# EAGLE design Tah (EAGLE 6.4)
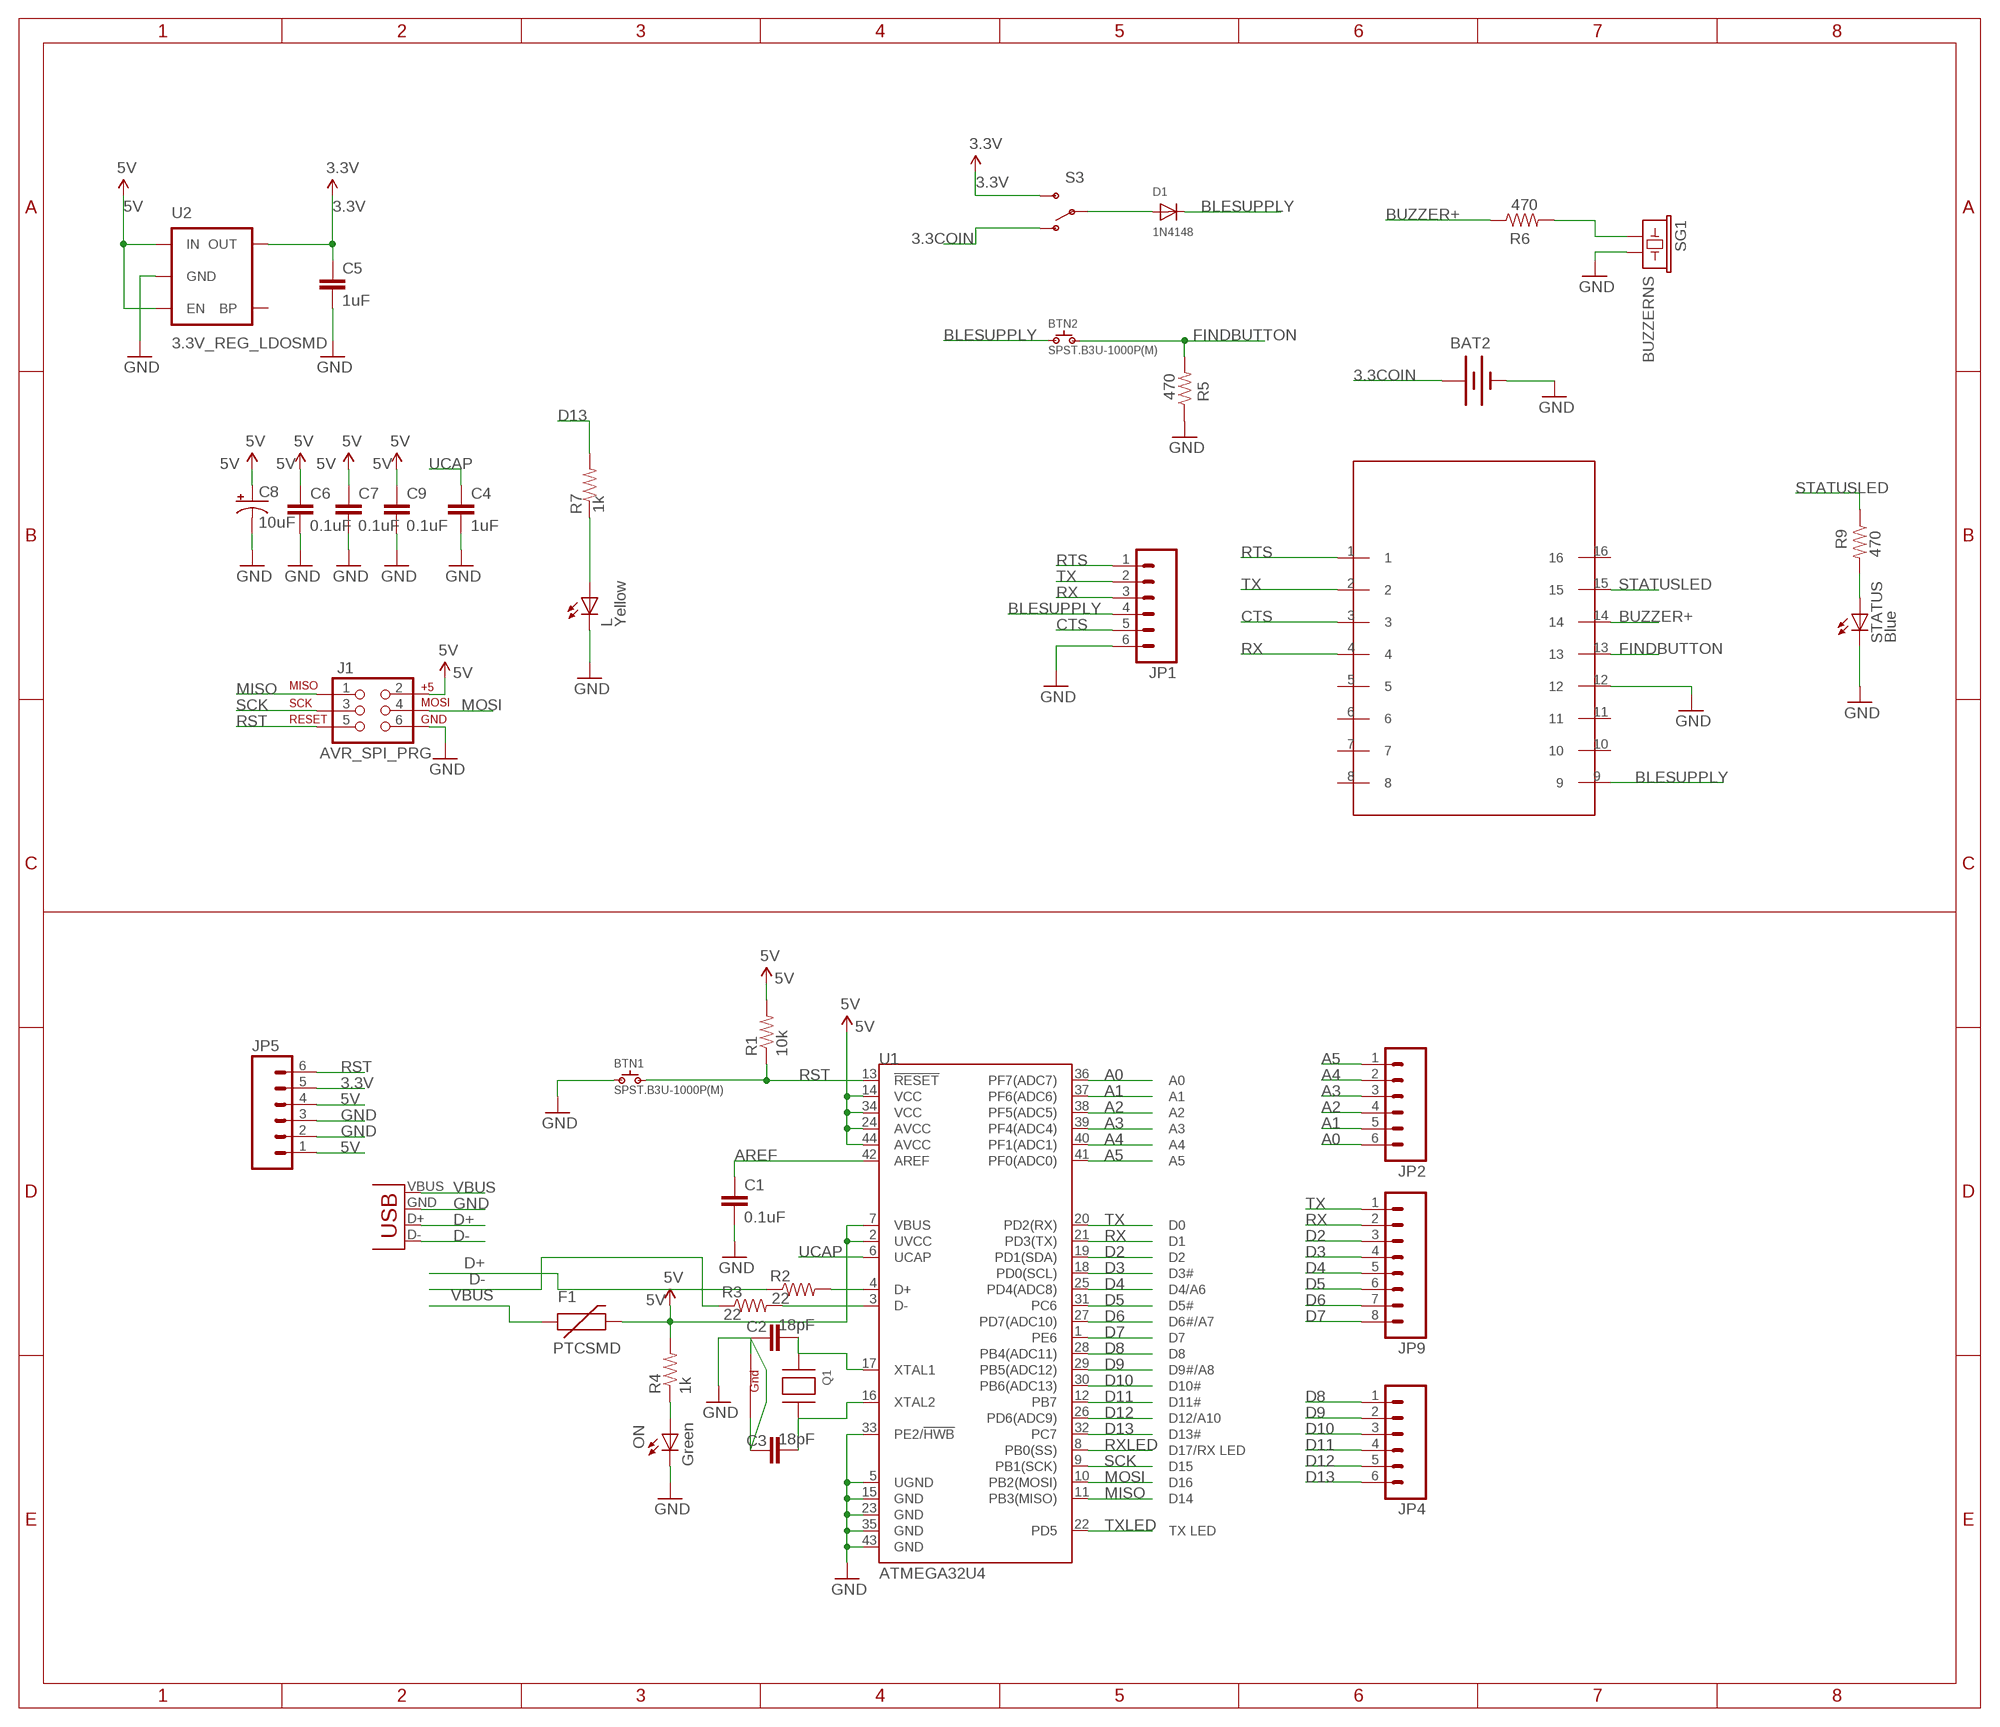
[diagram p0: schematic, sheet 1]

## Parts
BAT2  BATTERY20SMD  [BATTCON_20MM]
BLE  HM-11HM11  [BC05B-SMD]
BTN1  SPST.B3U-1000P(M)  [B3U-1000P(M)]
BTN2  SPST.B3U-1000P(M)  [B3U-1000P(M)]
C1  0.1uF  2.2UF-CERCAP-10009  [1206]
C2  18pF  2.2UF-CERCAP-10009  [1206]
C3  18pF  2.2UF-CERCAP-10009  [1206]
C4  1uF  2.2UF-CERCAP-10009  [1206]
C5  1uF  2.2UF-CERCAP-10009  [1206]
C6  0.1uF  2.2UF-CERCAP-10009  [1206]
C7  0.1uF  2.2UF-CERCAP-10009  [1206]
C8  10uF  CAP_POL1206  [EIA3216]
C9  0.1uF  2.2UF-CERCAP-10009  [1206]
D1  1N4148  DIODESMA  [SMADIODE]
F1  PTCSMD  [PTC-1206]
J1  AVR_SPI_PRG  AVR_SPI_PRG_6PTH  [2X3]
JP1  M06SIP  [1X06]
JP2  M06SIP  [1X06]
JP4  M06SIP  [1X06]
JP5  M06SIP  [1X06]
JP7  USB-A-H  [USB-A-H]
JP9  M081X08  [1X08]
L  Yellow  LEDSMT1206  [1206]
ON  Green  LEDSMT1206  [1206]
Q1  XTAL-4-3225  [NX3225]
R1  10k  RESISTOR1206  [1206]
R2  22  RESISTOR1206  [1206]
R3  22  RESISTOR1206  [1206]
R4  1k  RESISTOR1206  [1206]
R5  470  RESISTOR1206  [1206]
R6  470  RESISTOR1206  [1206]
R7  1k  RESISTOR1206  [1206]
R9  470  RESISTOR1206  [1206]
S3  SWITCH-SPDT-SMD-A  [SWITCH-SPST-SMD-A]
SG1  BUZZERNS  [BUZZER-12MM-NS]
STATUS  Blue  LEDSMT1206  [1206]
U1  ATMEGA32U4  ATMEGA32U4TQFP  [SPARKFUN-DIGITALIC_TQFP44]
U2  3.3V_REG_LDOSMD  V_REG_LDOSMD  [SOT23-5]

## Nets
3.3COIN: BAT2.1(+) S3.1(O)
3.3V: C5.1 JP5.5 S3.3(S) U2.5(OUT)
5V: C6.1 C7.1 C8.A(+) C9.1 F1.2 J1.2 JP5.1 JP5.4 R1.2 R4.2 U1.2(UVCC) U1.7(VBUS) U1.14(VCC) U1.24(AVCC) U1.34(VCC) U1.44(AVCC) U2.1(IN) U2.3(EN)
A0: JP2.6 U1.36(PF7(ADC7))
A1: JP2.5 U1.37(PF6(ADC6))
A2: JP2.4 U1.38(PF5(ADC5))
A3: JP2.3 U1.39(PF4(ADC4))
A4: JP2.2 U1.40(PF1(ADC1))
A5: JP2.1 U1.41(PF0(ADC0))
AREF: C1.1 U1.42(AREF)
BLESUPPLY: BLE.9 BTN2.1 D1.C JP1.4
BUZZER+: BLE.14 R6.1
CTS: BLE.3 JP1.5
D2: JP9.3 U1.19(PD1(SDA))
D3: JP9.4 U1.18(PD0(SCL))
D4: JP9.5 U1.25(PD4(ADC8))
D5: JP9.6 U1.31(PC6)
D6: JP9.7 U1.27(PD7(ADC10))
D7: JP9.8 U1.1(PE6)
D8: JP4.1 U1.28(PB4(ADC11))
D9: JP4.2 U1.29(PB5(ADC12))
D10: JP4.3 U1.30(PB6(ADC13))
D11: JP4.4 U1.12(PB7)
D12: JP4.5 U1.26(PD6(ADC9))
D13: JP4.6 R7.2 U1.32(PC7)
D+: JP7.D+(D-) R2.1
D-: JP7.D-(D+) R3.1
FINDBUTTON: BLE.13 BTN2.2 R5.2
GND: BAT2.2(-) BLE.12 BTN1.1 C1.2 C2.1 C3.1 C4.2 C5.2 C6.2 C7.2 C8.C(-) C9.2 J1.6 JP1.6 JP5.2 JP5.3 JP7.GND(VBUS) L.C ON.C Q1.2(G2) Q1.4(G1) R5.1 SG1.- STATUS.C U1.5(UGND) U1.15(GND) U1.23(GND) U1.33(PE2/!HWB) U1.35(GND) U1.43(GND) U2.2(GND)
MISO: J1.1 U1.11(PB3(MISO))
MOSI: J1.4 U1.10(PB2(MOSI))
N$1: L.A R7.1
N$2: C2.2 Q1.1(X1) U1.17(XTAL1)
N$3: C3.2 Q1.3(X2) U1.16(XTAL2)
N$4: R6.2 SG1.+
N$6: R2.2 U1.4(D+)
N$8: R3.2 U1.3(D-)
N$9: ON.A R4.1
N$11: R9.2 STATUS.A
N$17: D1.A S3.2(P)
RST: BTN1.2 J1.5 JP5.6 R1.1 U1.13(!RESET)
RTS: BLE.1 JP1.1
RX: BLE.4 JP1.3 JP9.2 U1.21(PD3(TX))
RXLED: U1.8(PB0(SS))
SCK: J1.3 U1.9(PB1(SCK))
STATUSLED: BLE.15 R9.1
TX: BLE.2 JP1.2 JP9.1 U1.20(PD2(RX))
TXLED: U1.22(PD5)
UCAP: C4.1 U1.6(UCAP)
VBUS: F1.1 JP7.VBUS(GND)
Unconnected: BLE.5 BLE.6 BLE.7 BLE.8 BLE.10 BLE.11 BLE.16 U2.4(BP)

## Library data of the parts
BAT2 = SparkFun-Electromechanical:BATTERY: Battery Holders Various common sizes : AA, AAA, 20mm coin cell and 12mm coin cell. 20MM_4LEGS, BATT-10373
BLE = HM-11:HM-11
BTN1 BTN2 = omron:SPST
C1-C7 C9 = SparkFun-Capacitors:2.2UF-CER: 2.2uF Ceramic SMT CAP-07888- 10V, 20% (0603) CAP-10009- 50V, 10% (1206); PROD_ID: CAP-10009; VALUE: 2.2uF
C8 = SparkFun:CAP_POL: Capacitor Polarized These are standard SMD and PTH capacitors. Normally 10uF, 47uF, and 100uF in electrolytic and tantalum varieties. Always verify the external diameter of the through hole cap, it varies with capacity, voltage, and manufacturer. The EIA devices should be standard.
D1 = 1n4148 diode sot 23:DIODE: Diode SMADIODE - SMA Surface Mount Package 20V 1A Schottky Diode Digikey: 641-1014-6-ND DO-1N4148 - Through Hole Small Current Diode SOD-123 20V 1 A (.5mV Vf) Schottky Diode - Digikey: MBRX120TPMSCT-ND SOD-323 10V 570mA (.38mV Vf, 3ns) Schottky Diode - Digikey: ZLLS410CT-ND SOD-523 30V 30mA Schottky Diode (RB751S-40TE61) - Digikey: RB751S-40TE61CT-ND SOT23-R/W - SOT23 Package (R = Solder Paste/Reflow Ovens, W = Hand-Soldering) BAT54Film 40V 300mA - Digikey: 497-7162-1-ND
F1 = SparkFun:PTC: Resettable Fuse PTC Resettable Fuse. Spark Fun Electronics SKU : COM-08357
J1 = SparkFun:AVR_SPI_PRG_6: AVR ISP 6 Pin This is the reduced ISP connector for AVR programming. Common on Arduino. This footprint will take up less PCB space and can be used with a 10-pin to 6-pin adapter such as SKU: BOB-08508
JP1 JP2 JP4 JP5 = SparkFun-Connectors:M06: Header 6 Standard 6-pin 0.1" header. Use with straight break away headers (SKU : PRT-00116), right angle break away headers (PRT-00553), swiss pins (PRT-00743), machine pins (PRT-00117), and female headers (PRT-00115). Molex polarized connector foot print use with SKU : PRT-08094 with associated crimp pins and housings. NOTES ON THE VARIANTS LOCK and LOCK_LONGPADS... This footprint was designed to help hold the alignment of a through-hole component (i.e. 6-pin header) while soldering it into place. You may notice that each hole has been shifted either up or down by 0.005 of an inch from it's more standard position (which is a perfectly straight line). This slight alteration caused the pins (the squares in the middle) to touch the edges of the holes. Because they are alternating, it causes a "brace" to hold the component in place. 0.005 has proven to be the perfect amount of "off-center" position when using our standard breakaway headers. Although looks a little odd when you look at the bare footprint, once you have a header in there, the alteration is very hard to notice. Also, if you push a header all the way into place, it is covered up entirely on the bottom side. This idea of altering the position of holes to aid alignment will be further integrated into the Sparkfun Library for other footprints. It can help hold any component with 3 or more connection pins.
JP7 = SparkFun-Connectors:USB: USB Connectors USB-B-PTH is fully proven SKU : PRT-00139/CONN-08278 USB-miniB is fully proven SKU : PRT-00587 USB-A-PCB is untested. USB-A-H is throughly reviewed, but untested. Spark Fun Electronics SKU : PRT-00437 USB-B-SMT is throughly reviewed, but untested. Needs silkscreen touching up. USB-A-S has not been used/tested USB-MB-H has not been used/tested USB-MICROB has been used. CONN-09505
JP9 = SparkFun-Connectors:M08: Header 8 Standard 8-pin 0.1" header. Use with straight break away headers (SKU : PRT-00116), right angle break away headers (PRT-00553), swiss pins (PRT-00743), machine pins (PRT-00117), and female headers (PRT-00115).
L ON STATUS = 1n4148 diode sot 23:LED: LED OSRAM: - CHIPLED LG R971, LG N971, LY N971, LG Q971, LY Q971, LO R971, LY R971 LH N974, LH R974 LS Q976, LO Q976, LY Q976 LO Q996 - Hyper CHIPLED LW Q18S LB Q993, LB Q99A, LB R99A - SideLED LS A670, LO A670, LY A670, LG A670, LP A670 LB A673, LV A673, LT A673, LW A673 LH A674 LY A675 LS A676, LA A676, LO A676, LY A676, LW A676 LS A679, LY A679, LG A679 - Hyper Micro SIDELED® LS Y876, LA Y876, LO Y876, LY Y876 LT Y87S - SmartLED LW L88C, LW L88S LB L89C, LB L89S, LG L890 LS L89K, LO L89K, LY L89K LS L896, LA L896, LO L896, LY L896 - TOPLED LS T670, LO T670, LY T670, LG T670, LP T670 LSG T670, LSP T670, LSY T670, LOP T670, LYG T670 LG T671, LOG T671, LSG T671 LB T673, LV T673, LT T673, LW T673 LH T674 LS T676, LA T676, LO T676, LY T676, LB T676, LH T676, LSB T676, LW T676 LB T67C, LV T67C, LT T67C, LS T67K, LO T67K, LY T67K, LW E67C LS E67B, LA E67B, LO E67B, LY E67B, LB E67C, LV E67C, LT E67C LW T67C LS T679, LY T679, LG T679 LS T770, LO T770, LY T770, LG T770, LP T770 LB T773, LV T773, LT T773, LW T773 LH T774 LS E675, LA E675, LY E675, LS T675 LS T776, LA T776, LO T776, LY T776, LB T776 LHGB T686 LT T68C, LB T68C - Hyper Mini TOPLED® LB M676 - Mini TOPLED Santana® LG M470 LS M47K, LO M47K, LY M47K Source: http://www.osram.convergy.de/
Q1 = adafruit:XTAL-4: Classic 4-pin 3.2 x 2.5mm crystal
R1-R7 R9 = SparkFun-Resistors:RESISTOR: Resistor Basic schematic elements and footprints for 0603, 1206, and PTH resistors.
S3 = SparkFun-Electromechanical:SWITCH-SPDT: SPDT Switch Simple slide switch, Spark Fun Electronics SKU : COM-00102 DPDT SMT slide switch, AYZ0202, SWCH-08179
SG1 = SparkFun-Electromechanical:BUZZER: Buzzer 12mm Spark Fun Electronics SKU : Comp-Buzzer
U1 = FTDI modifed:ATMEGA32U4: Atmel 44-pin 8-bit Microcontroller with 32KBytes of ISP Flash and USB Controller
U2 = SparkFun:V_REG_LDO: Voltage Regulator LDO Standard 150mA LDO voltage regulator in SOT-23 layout. Micrel part MIC5205. BP (by-pass) pin is used to lower output noise with 470pF cap.

## Net classes
0 default: clearance 0.355 mm

## Board
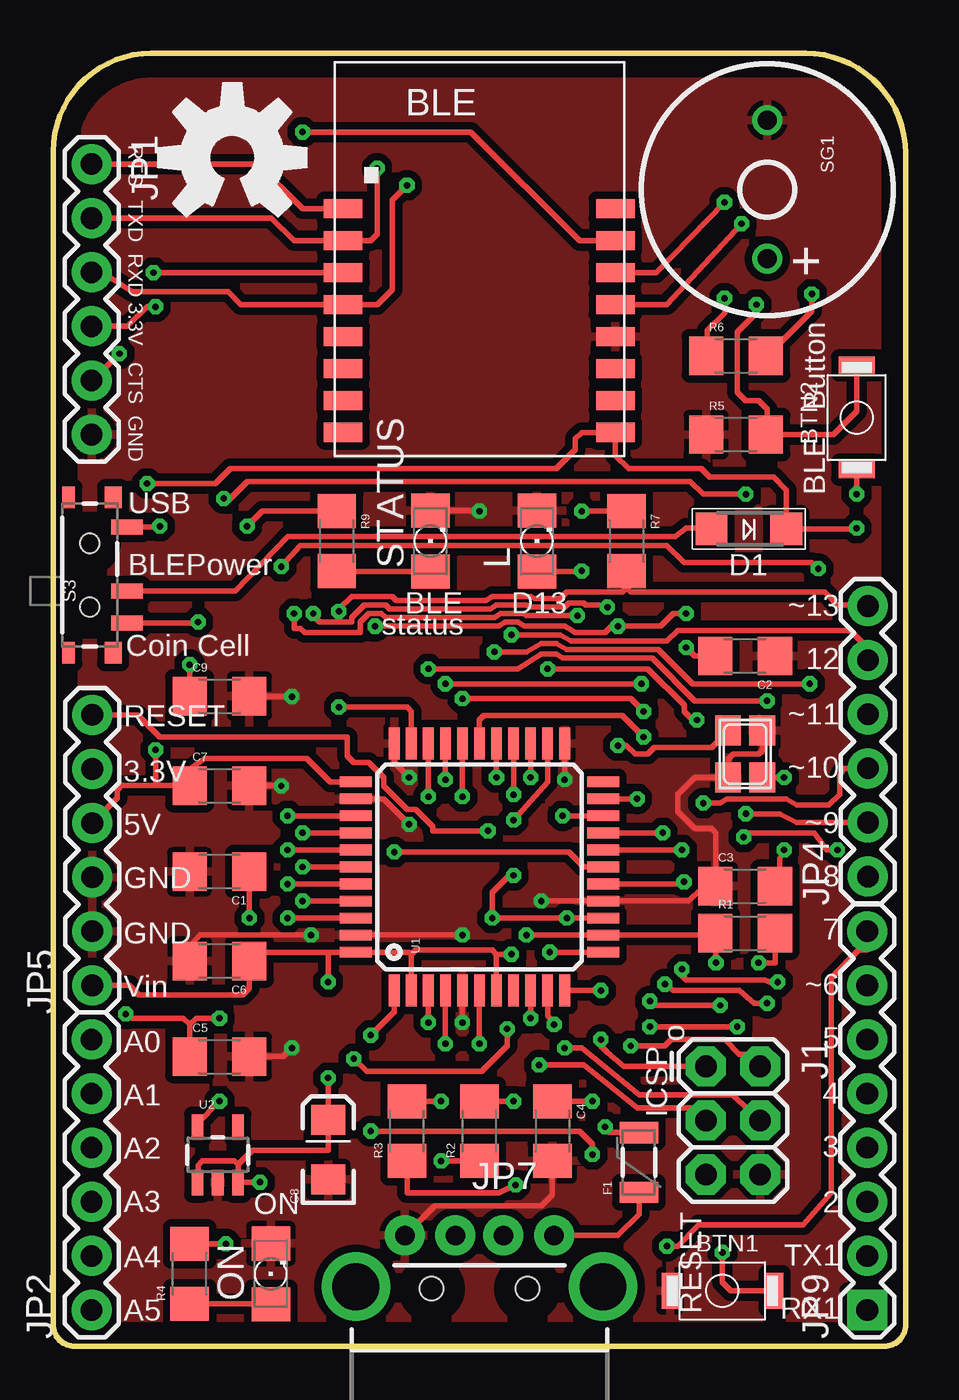
[diagram p1: board, top side]
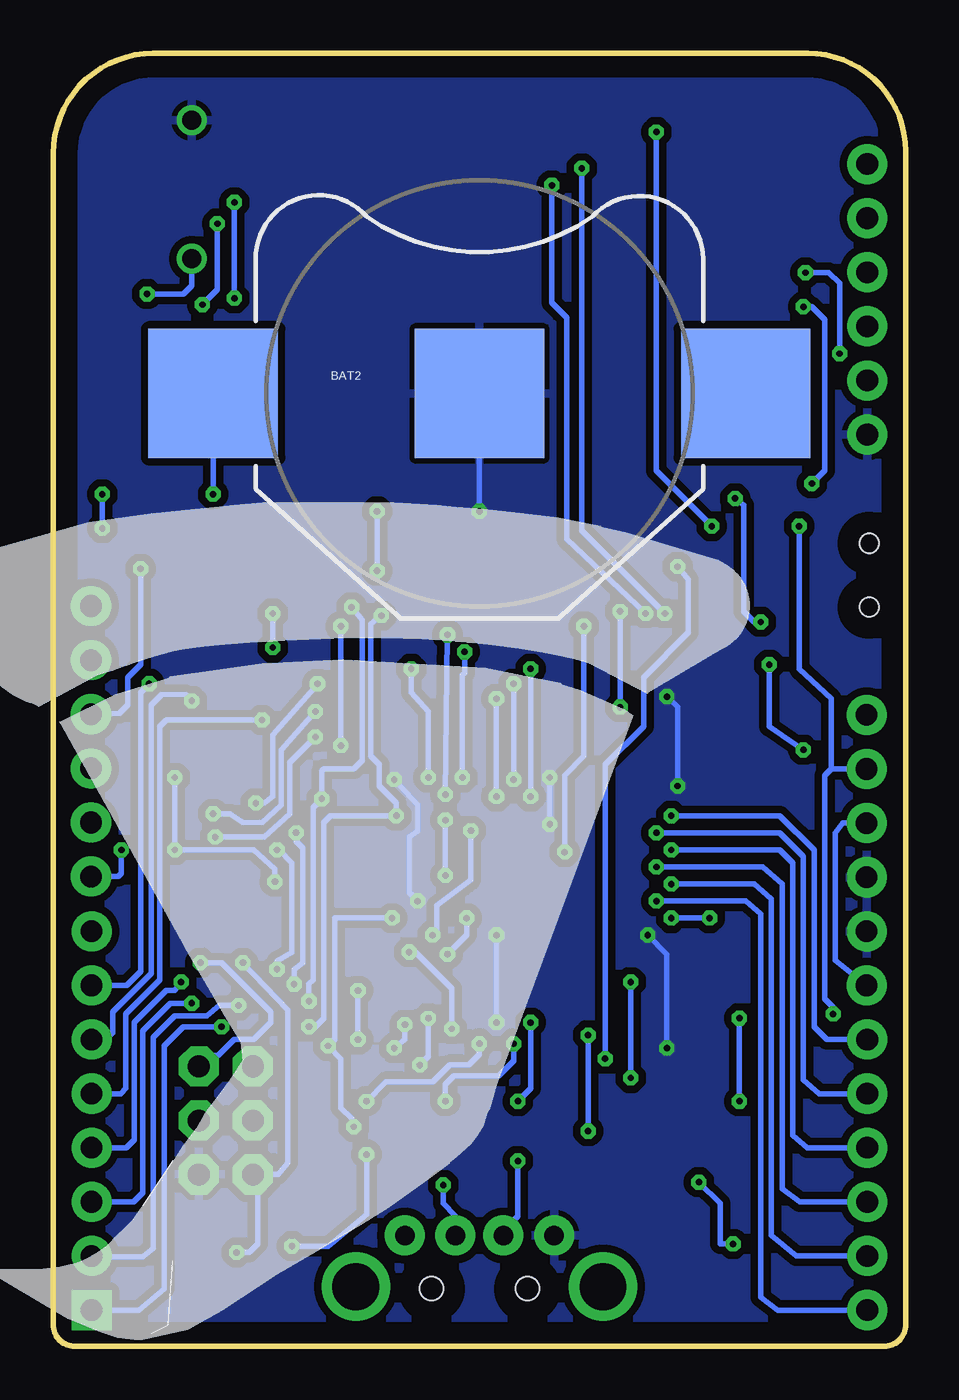
[diagram p2: board, bottom side, seen from below]

Size 40 x 60.7 mm. Coordinates in mm from the lower left corner, seen from the top.
Outline: 4.6,60.7 arc90 0,56.1 0,1 arc90 1,0 39,0 arc90 40,1 40,56 arc90 35.3,60.7 4.6,60.7
Copper layers (1*16): Top 0.035mm / dielectric 1.5mm / Bottom 0.035mm
Design rules "default": minimum track width 10mil, minimum drill 24mil, track to track 8mil, track to pad 8mil, pad to pad 8mil, via to via 8mil, smd to smd 8mil, copper to edge 40mil, drill to drill 8mil, minimum pad ring 10mil, minimum via ring 8mil, stop-mask expansion 4mil, vias tented up to drill 0mil, thermal gap 10mil

### Footprints (pad centres in the part's own frame; a part is rotated, then mirrored left to right if it is on the bottom)
BATTCON_20MM = smd 6.07 x 6.07: 1 -12.5,0; 2 0,0; 3 12.5,0
BC05B-SMD = smd 1.8 x 0.9: 1 -6.4,3.4; 2 -6.4,1.9; 3 -6.4,0.4; 4 -6.4,-1.1; 5 -6.4,-2.6; 6 -6.4,-4.1; 7 -6.4,-5.6; 8 -6.4,-7.1; 9 6.38,-7.1; 10 6.38,-5.6; 11 6.38,-4.1; 12 6.38,-2.6; 13 6.38,-1.1; 14 6.38,0.4; 15 6.38,1.9; 16 6.38,3.4
B3U-1000P(M) = smd 0.8 x 1.7: 1 -2.45,0; 2 2.45,0
1206 = smd 1.6 x 1.8: 1 -1.4,0; 2 1.4,0
EIA3216 = smd 1.4 x 1.6: A 1.4,0; C -1.4,0
SMADIODE = smd 1.524 x 1.5: A -0.05,-1.6; C -0.05,1.9
PTC-1206 = smd 1 x 1.8: 1 -1.4,0; 2 1.4,0
2X3 = drill 1.016 pad 1.88 octagon: 1 0,0; 2 0,2.54; 3 2.54,0; 4 2.54,2.54; 5 5.08,0; 6 5.08,2.54
1X06 = drill 1.016 pad 1.88: 1 0,0; 2 2.54,0; 3 5.08,0; 4 7.62,0; 5 10.16,0; 6 12.7,0
USB-A-H = drill 0.914 pad 1.88: D+ 2.4,1.127; D- 2.4,-1.127; GND 2.4,3.5; VBUS 2.4,-3.5 | drill 2.2: GND2 0,-5.8; GND3 0,5.8 | hole 1.1: -0.1,2.25; -0.1,-2.25
1X08 = drill 1.016 pad 1.88 square: 1 0,0 | drill 1.016 pad 1.88: 2 2.54,0; 3 5.08,0; 4 7.62,0; 5 10.16,0; 6 12.7,0; 7 15.24,0; 8 17.78,0
1206' = smd 1.6 x 1.803: A -1.422,0; C 1.422,0
NX3225 = smd 1.4 x 1.2: 1 -1.1,-0.8; 2 1.1,-0.8; 3 1.1,0.8; 4 -1.1,0.8
SWITCH-SPST-SMD-A = smd 0.7 x 1.5: 1 -2.25,-1.75; 2 -0.75,-1.75; 3 2.25,-1.75 | smd 1 x 0.6: GND1 -3.65,1; GND3 3.65,1 | smd 1 x 0.8: GND2 -3.65,-1.1; GND4 3.65,-1.1 | hole 0.9: -1.5,0; 1.5,0
BUZZER-12MM-NS = drill 0.9: + 3.25,0; - -3.25,0
SPARKFUN-DIGITALIC_TQFP44 = smd 1.5 x 0.5: 1 -5.8,4; 2 -5.8,3.2; 3 -5.8,2.4; 4 -5.8,1.6; 5 -5.8,0.8; 6 -5.8,0; 7 -5.8,-0.8; 8 -5.8,-1.6; 9 -5.8,-2.4; 10 -5.8,-3.2; 11 -5.8,-4; 23 5.8,-4; 24 5.8,-3.2; 25 5.8,-2.4; 26 5.8,-1.6; 27 5.8,-0.8; 28 5.8,0; 29 5.8,0.8; 30 5.8,1.6; 31 5.8,2.4; 32 5.8,3.2; 33 5.8,4 | smd 0.5 x 1.5: 12 -4,-5.8; 13 -3.2,-5.8; 14 -2.4,-5.8; 15 -1.6,-5.8; 16 -0.8,-5.8; 17 0,-5.8; 18 0.8,-5.8; 19 1.6,-5.8; 20 2.4,-5.8; 21 3.2,-5.8; 22 4,-5.8; 34 4,5.8; 35 3.2,5.8; 36 2.4,5.8; 37 1.6,5.8; 38 0.8,5.8; 39 0,5.8; 40 -0.8,5.8; 41 -1.6,5.8; 42 -2.4,5.8; 43 -3.2,5.8; 44 -4,5.8
SOT23-5 = smd 0.55 x 1.2: 1 -0.95,-1.3; 2 0,-1.3; 3 0.95,-1.3; 4 0.95,1.3; 5 -0.95,1.3

### Placement (x,y rotation side)
BAT2  20,44.73 0 bottom
BLE  20,50 0 top
BTN1  31.4,2.6 0 top
BTN2  37.7,43.6 90 top
C1  7.8,22.28 180 top
C2  32.47,32.4 180 top
C3  32.47,21.6 0 top
C4  23.42,10.1 270 top
C5  7.8,13.6 0 top
C6  7.8,18.08 180 top
C7  7.8,26.32 0 top
C8  12.9,9.23 90 top
C9  7.8,30.52 0 top
D1  32.49,38.32 270 top
F1  27.48,8.63 90 top
J1  30.63,13.14 270 top
JP1  1.8,55.5 270 top
JP2  1.8,1.7 90 top
JP4  38.23,22.05 90 top
JP5  1.83,16.94 90 top
JP7  20,2.8 90 top
JP9  38.2,1.7 90 top
L  Yellow  [1206']  22.7,37.8 90 top
ON  Green  [1206']  10.21,3.4 90 top
Q1  32.47,27.8 270 top
R1  32.47,19.4 0 top
R2  20,10.1 90 top
R3  16.6,10.1 90 top
R4  6.4,3.4 90 top
R5  32.04,42.8 0 top
R6  32.04,46.5 0 top
R7  26.9,37.8 270 top
R9  13.3,37.8 270 top
S3  1.71,36.2 90 top
SG1  33.5,54.3 270 top
STATUS  Blue  [1206']  17.7,37.8 90 top
U1  20,22.5 90 top
U2  7.72,8.99 0 top
U$1  [TAHLOGO]  27.2,19.2 0 bottom
U$3  [OSHW-LOGO-L]  8.4,55.8 0 top

### Tracks (layer width: path | path; a pad name or v marks a point on that pad's centre or on a via)
3.3COIN  (via drill 0.3)
  Top 0.254: S3.1 6.75,33.95 v6.8,34 | v8,39.8 8.3,39.8 9.1,40.6 29.9,40.6 30.5,40 v32.5,40
  Bottom 0.254: v6.8,34 7.1,34 7.6,34.5 7.6,39.5 v8,39.8 | v32.5,40 BAT2.1
3.3V  (via drill 0.3)
  Top 0.254: C5.1 6.4,15.1 | 6.4,15.1 6.1,15.4 3.7,15.4 v3.4,15.6 | U2.5 6.77,10.47 v7.8,11.5 | v7.8,15.4 6.7,15.4 6.4,15.1 | S3.3 4.95,38.45 v5,38.5
  Bottom 0.254: v3.4,15.6 3.4,15.9 3.8,16.3 3.8,26.8 3.5,27.1 | 3.5,27.1 JP5.5 | v7.8,11.5 v7.8,15.4 | v5,38.5 5,31.8 3.5,30.4 3.5,27.1
5V  (via drill 0.3)
  Top 0.254: 8.67,8.53 U2.3 v9.7,7.7 | 8.67,8.53 8.5,8.7 7,8.7 6.8,8.5 6.8,7.72 U2.1 | 8.67,8.53 9.34,9.2 12.9,9.2 C8.A v12.9,12.6 | JP5.1 3.56,16.94 4,16.5 8.9,16.5 9.2,16.8 C6.1 9.62,18.5 13,18.5 | 13,18.5 U1.44 16.7,18.5 16.8,18.4 | U1.34 13,26.5 11.9,27.6 7.1,27.6 6.4,27.1 C7.1 5,26.32 | R4.2 v8.1,4.8 | F1.2 26.07,10.03 v25.9,10.3 | v27.1,14.1 28.7,14.1 29,14.4 31.5,14.4 32.2,13.7 32.61,13.7 J1.2 | R1.2 33.87,18 v33.1,18 | U1.14 v24.1,20.1 v20.6,20.1 20.6,21.3 21.4,22.1 v21.6,22.1 | U1.7 20.8,18.4 | 20.8,18.4 20.6,18.6 17,18.6 16.8,18.4 | 16.8,18.4 U1.2 | v21.5,18.4 20.8,18.4 | 5,26.32 3.22,26.32 3,26.1 3,25.73 JP5.4 | U1.24 23.2,26.5 v21.6,24.7 | C9.1 v6.4,32 | v4.8,28 4.8,26.52 5,26.32 | v12.9,17.1 12.9,18.4 13,18.5
  Bottom 0.254: JP5.4 2.94,24.56 3.3,24.1 3.3,18.11 JP5.1 | v8.1,4.8 8.7,4.8 8.7,6.7 v9.7,7.7 | v25.9,10.3 26,10.7 26.5,11.2 26.5,13.5 v27.1,14.1 26.8,14.4 26.8,20.1 v24.1,20.1 | v33.1,18 32.1,18 29.8,15.7 29.8,15.2 30.6,14.4 31.5,14.4 32.25,13.65 32.66,13.65 J1.2 | v20.6,20.1 20.6,19.3 v21.5,18.4 | v21.6,24.7 v21.6,22.1 | v6.4,32 6.4,29.1 v4.8,28 | v12.9,12.6 v12.9,17.1
A0  (via drill 0.3)
  Top 0.254: v11,24.9 U1.36
  Bottom 0.254: JP2.6 3.7,14.4 4.3,15 4.3,23.3 5.9,24.9 v11,24.9
A1  (via drill 0.3)
  Top 0.254: v11.7,24.1 U1.37
  Bottom 0.254: JP2.5 4.06,11.86 4.8,12.5 4.8,23 5.9,24.1 v11.7,24.1
A2  (via drill 0.3)
  Top 0.254: v11,23.3 U1.38
  Bottom 0.254: JP2.4 4.62,9.32 5.3,9.9 5.3,22.7 5.9,23.3 v11,23.3
A3  (via drill 0.3)
  Top 0.254: v11.7,22.5 U1.39
  Bottom 0.254: JP2.3 4.98,6.78 5.8,7.4 5.8,21.7 6.7,22.5 v11.7,22.5
A4  (via drill 0.3)
  Top 0.254: v11,21.7 U1.40
  Bottom 0.254: JP2.2 5.14,4.24 6.3,5.2 6.3,21 7.1,21.7 v11,21.7
A5  (via drill 0.3)
  Top 0.254: v11.7,20.9 U1.41
  Bottom 0.254: JP2.1 6,1.7 6.8,2.3 6.8,20.3 7.5,20.9 v11.7,20.9
AREF  (via drill 0.3)
  Top 0.254: U1.42 v11,20.1 | v9.2,20.1 C1.1
  Bottom 0.254: v11,20.1 v9.2,20.1
BLESUPPLY  (via drill 0.3)
  Top 0.254: v37.7,38.4 37.67,38.37 D1.C 34.4,40.2 33.8,40.8 30.8,40.8 30.4,41.2 27,41.2 26.38,41.82 BLE.9 24.8,42.9 24.5,42.6 24.5,42.1 23.6,41.2 8.3,41.2 7.6,40.5 v4.4,40.5 | v37.7,40 BTN2.1 | JP1.4 3.48,47.88 4.4,48.8 v4.8,48.8
  Bottom 0.254: v37.7,38.4 v37.7,40 | v4.8,48.8 4.4,48.8 3.8,48.2 3.8,41.1 v4.4,40.5
BUZZER+  (via drill 0.3)
  Top 0.254: BLE.14 28.3,50.4 v31.5,53.7 | v31.5,49.2 31.5,48.5 30.7,47.7 30.7,46.56 R6.1
  Bottom 0.254: v31.5,53.7 v31.5,49.2
CTS  (via drill 0.3)
  Top 0.254: JP1.5 1.84,45.34 v3.1,46.6 | v4.7,50.4 BLE.3
  Bottom 0.254: v3.1,46.6 3.1,49.9 3.6,50.4 v4.7,50.4
D2  (via drill 0.3)
  Top 0.254: v33.5,16.1 32.9,16.1 32.2,16.7 29.1,16.7 v28.7,17 | v28.6,24.1 U1.19
  Bottom 0.254: JP9.3 36.22,6.78 35.8,7.2 35.8,14.8 34.5,16.1 v33.5,16.1 | v28.7,17 28.7,17.7 28.3,18 28.3,23.4 28.6,23.7 v28.6,24.1
D3  (via drill 0.3)
  Top 0.254: v34,17.1 33.6,17.1 33.4,17.2 29.7,17.2 29.5,17.4 v29.5,17.7 | v29.5,23.3 U1.18
  Bottom 0.254: JP9.4 36.58,9.32 36.2,9.7 36.2,15.2 34.7,16.7 34.3,16.7 v34,17.1 | v29.5,17.7 29.5,18.1 28.8,18.5 28.8,22.7 29.4,23.3 v29.5,23.3
D4  (via drill 0.3)
  Top 0.254: v30.2,29.4 30,29.4 29.6,29.8 29.6,30.1 27.9,31.8 v23.2,31.8 | v22.4,26.7 U1.25
  Bottom 0.254: JP9.5 36.84,11.86 36.6,12.1 36.6,15.6 35,17.2 35,29.1 34.7,29.4 v30.2,29.4 | v23.2,31.8 23.2,30.7 22.4,29.8 v22.4,26.7
D5  (via drill 0.3)
  Top 0.254: v33.5,30.3 30.1,30.3 28.1,32.3 23.9,32.3 23.6,32.5 22.9,32.5 21.8,31.8 v17.6,31.8 | v17.6,25.8 U1.31
  Bottom 0.254: JP9.6 37.5,14.4 37.2,14.7 37.2,15.7 35.4,17.5 35.4,30.1 34.9,30.6 33.8,30.6 v33.5,30.3 | v17.6,31.8 v17.6,25.8
D6  (via drill 0.3)
  Top 0.254: v35.5,31.1 30,31.1 28.4,32.7 24.1,32.7 23.6,33 22.9,33 22.2,32.6 v20.7,32.6 | v20.8,26.7 U1.27
  Bottom 0.254: JP9.7 36.56,16.94 35.9,17.6 35.9,30.7 v35.5,31.1 | v20.7,32.6 20.7,31.6 20.8,31.5 v20.8,26.7
D7  (via drill 0.3)
  Top 0.254: v28.8,4.7 29.3,4.7 30.3,5.7 35.2,5.7 36.5,7.2 36.5,17.3 37.8,18.6 38.2,18.6 JP9.8 | v14.9,10.1 24.7,10.1 25.3,9.5 v25.3,9 | v14.9,14.6 16,15.7 U1.1
  Bottom 0.254: v28.8,4.7 27.1,4.7 25.3,6.2 v25.3,9 | v14.9,14.6 v14.9,10.1
D8  (via drill 0.3)
  Top 0.254: v36.8,23.3 36.3,23.3 35.7,24.1 32.5,24.1 32.4,24 v32.4,23.9 | v27.7,28.6 26.7,29.6 20.2,29.6 20,29.4 U1.28
  Bottom 0.254: JP4.1 36.95,22.05 36.8,22.2 v36.8,23.3 | v32.4,23.9 30.1,23.9 28.9,25 28.9,27.4 v27.7,28.6
D9  (via drill 0.3)
  Top 0.254: JP4.2 37.91,24.59 37.6,24.6 34.9,24.6 34.1,25 v32.5,25 | v27.7,29.8 27.1,30.4 v19.2,30.4 | v19.2,25.8 U1.29
  Bottom 0.254: v32.5,25 31.7,25 31.1,24.6 30.2,24.6 29.3,25.4 29.3,28 v27.7,29.8 | v19.2,30.4 v19.2,25.8
D10  (via drill 0.3)
  Top 0.254: JP4.3 37.13,27.13 36.9,26.8 36.9,25.9 36.4,25.4 34.9,25.4 34.4,25.7 31.6,25.7 31.3,25.5 v30.5,25.5 | v27.6,31.1 v18.4,31.1 | v18.4,26.6 U1.30
  Bottom 0.254: v30.5,25.5 30.1,25.5 29.7,25.8 29.7,28.7 v27.6,31.1 | v18.4,31.1 v18.4,26.6
D11  (via drill 0.3)
  Top 0.254: U1.12 v23.3,18.5 | v21.3,14.9 21.3,14.1 20.1,12.9 14.7,12.9 v14.1,13.5 | v10.7,36.6 11.6,37.6 28.8,37.6 29.6,36.8 35.6,36.8 v35.9,36.5
  Bottom 0.254: v23.3,18.5 23,18.5 21.3,16.8 v21.3,14.9 | v14.1,13.5 14.1,27.3 12.3,29.1 12.3,31.4 10.2,33.5 10.2,36 v10.7,36.6 | v35.9,36.5 35.9,32 36.5,31.4 36.5,30.1 36.9,29.7 38.2,29.7 JP4.4
D12  (via drill 0.3)
  Top 0.254: JP4.5 38.23,32.77 37.4,33.6 29.3,33.6 28.8,33.1 24.3,33.1 23.8,33.4 v21.5,33.4 | v21.6,25.9 U1.26
  Bottom 0.254: v21.5,33.4 v21.6,25.9
D13  (via drill 0.3)
  Top 0.254: U1.32 16.8,29.8 16.6,30 v13.4,30 | v13.4,34.5 13.4,34.6 14,35.2 15.9,35.2 16.1,35 20.3,35 20.6,35.2 22.4,35.2 22.6,35.1 23.8,35.1 24.1,35.4 26.7,35.4 26.9,35.6 | 26.9,35.6 R7.2 | 26.9,35.6 27.1,35.4 36.2,35.4 36.8,34.8 38.18,34.8 JP4.6
  Bottom 0.254: v13.4,30 v13.4,34.5
D+  (via drill 0.3)
  Top 0.254: v18.2,8.7 R2.1
  Bottom 0.254: JP7.D+ 18.87,5.43 18.2,6.1 v18.2,8.7
D-  (via drill 0.3)
  Top 0.254: v21.7,7.57 20.9,7.2 16.6,7.2 R3.1
  Bottom 0.254: JP7.D- 21.13,6.13 21.7,6.7 v21.7,7.57
FINDBUTTON  (via drill 0.3)
  Top 0.254: BTN2.2 37.7,43.9 36.6,42.8 R5.2 33.5,42.86 33.5,44 33.1,44.4 32.5,44.4 32.1,44.8 32.1,47.6 33,48.5 v33,48.9 | BLE.13 28.8,48.9 v32.3,52.7
  Bottom 0.254: v32.3,52.7 32.3,49.6 v33,48.9
GND  (via drill 0.3)
  Top 0.254: Q1.4 33.3,28.87 33.3,28 33.1,27.8 31.9,27.8 31.67,27.57 Q1.2 30.1,26.7 29.3,25.9 29.3,25.1 30.1,24.3 30.9,24.3 31.1,24.1 31.1,21.63 C3.1 30.6,21.6 29.8,20.9 U1.15 v22.9,20.9 | U1.5 v19.2,15.2 | v19.2,19.3 U1.43 | U1.23 v24,26.6 | C4.2 23.42,7.12 22.9,6.6 17.9,6.6 JP7.GND | C7.2 10.68,26.32 v10.7,26.3 | v11.2,30.5 9.22,30.5 C9.2 | U1.35 15.5,25.7 v16.7,24.5 | v16.7,26.7 16,27.4 U1.33 | STATUS.C 20.18,39.22 v20,39.2 | C5.2 10.8,13.6 v11.2,14 | v12.1,19.3 6.9,19.3 6.4,18.8 C6.2
  Bottom 0.254: v19.2,15.2 v19.2,19.3 | v24,26.6 22.9,25.4 22.9,24.2 23.3,23.9 23.3,21.3 v22.9,20.9 | v10.7,26.3 10.7,30 v11.2,30.5 | v16.7,24.5 v16.7,26.7 | v20,39.2 BAT2.2 | v11.2,14 11.2,18.4 v12.1,19.3
  pour Top: 4.7,60.7 35.2,60.7 arc-90 40,56.1 40.1,0 0,0 0,56.2 arc-90
  pour Bottom: 4.7,60.7 35.2,60.7 arc-90 40,56.1 40.1,0 0,0 0,56.2 arc-90
MISO  (via drill 0.3)
  Top 0.254: J1.1 26.76,13.14 26,13.8 25.7,14.1 v25.7,14.4 | v25.7,16.7 U1.11
  Bottom 0.254: v25.7,14.4 v25.7,16.7
MOSI  (via drill 0.3)
  Top 0.254: U1.10 23.2,15.5 v23.5,15.1 | v24,14 24.8,14 27.5,11.8 31.87,11.8 J1.4
  Bottom 0.254: v23.5,15.1 23.5,14.4 v24,14
N$1  (via drill 0.3)
  Top 0.254: L.A 24.78,36.38 v24.8,36.4 | v24.8,39.2 R7.1
  Bottom 0.254: v24.8,36.4 v24.8,39.2
N$2  (via drill 0.3)
  Top 0.254: v26.5,28.2 26.9,28.2 27.3,27.8 27.9,27.8 28.2,28.1 30.9,28.1 31.7,28.9 Q1.1 | v15.1,33.8 20.9,33.8 21.2,34 21.8,34 22.1,33.8 24,33.8 24.5,33.5 25.9,33.5 26.2,33.8 v26.5,33.8 28.5,33.8 29.1,34.4 v29.7,34.4 | v16,23.2 24.2,23.2 24.9,22.5 U1.17 | C2.2 30.1,32.4 v29.7,32.8
  Bottom 0.254: v26.5,33.8 v26.5,28.2 | v15.1,33.8 15.1,27.7 16,26.8 v16,23.2 | v29.7,32.8 v29.7,34.4
N$3  (via drill 0.3)
  Top 0.254: Q1.3 v34.3,26.7 | v34.3,23.3 34.1,22.9 34.1,22.03 C3.2 | U1.16 29.5,21.7 v29.6,21.8
  Bottom 0.254: v34.3,26.7 v34.3,23.3 30.6,23.3 29.6,22.4 v29.6,21.8
N$4  (via drill 0.3)
  Top 0.254: v35.6,49.4 35.6,48.6 33.56,46.56 33.5,46.56 R6.2
  Bottom 0.254: SG1.+ 33.5,49.8 33.9,49.4 v35.6,49.4
N$6  (via drill 0.3)
  Top 0.254: U1.4 v18.4,14.2 | v21.6,11.5 R2.2
  Bottom 0.254: v18.4,14.2 18.4,13.4 19.1,12.7 21.2,12.7 21.6,12.3 v21.6,11.5
N$8  (via drill 0.3)
  Top 0.254: U1.3 v17.6,15.2 | v18.2,11.5 R3.2
  Bottom 0.254: v17.6,15.2 17.6,12.1 v18.2,11.5
N$9
  Top 0.254: R4.1 10.19,2 ON.A
N$11
  Top 0.254: STATUS.A 13.32,36.38 R9.2
N$17
  Top 0.254: S3.2 8.55,35.45 11,38 29.2,38 29.7,38.4 30.86,38.4 D1.A
RST  (via drill 0.3)
  Top 0.254: v31.1,18 31.1,19.37 R1.1 30.67,19.3 U1.13 v22.2,19.3 | JP5.6 3.96,29.64 5,28.6 13.8,28.6 13.8,27.7 14.1,27.4 14.8,27.4 15.5,26.7 15.5,26.3 16.6,25.2 17,25.2 17.8,24.4 17.8,24.2 v20.4,24.2 | v31.4,4.4 31.4,3 31.8,2.6 BTN1.2
  Bottom 0.254: v31.1,18 29,15.8 29,8.6 29.44,8.06 J1.5 30.63,7.73 30.4,7.5 30.4,4.8 30.8,4.4 v31.4,4.4 | v20.4,24.2 20.4,21.9 22,20.7 22,19.5 v22.2,19.3
RTS
  Top 0.254: JP1.1 9.6,55.5 11.7,53.4 BLE.1
RX  (via drill 0.3)
  Top 0.254: v31.3,16 28.2,16 v28,16.2 | v27.4,25.7 U1.21 | JP1.3 2.28,50.42 3.7,49.5 8.2,49.5 8.8,48.9 BLE.4 15.2,48.9 15.9,49.6 15.9,53.8 v16.6,54.5 | v26,34.7 25.6,34.8 25,34.8 24.9,34.9 24.2,34.9 24,34.7 22.4,34.7 22.2,34.8 20.8,34.8 20.5,34.6 15.8,34.6 15.6,34.8 14.6,34.8 14,34.2 14,34 12.5,34 12.2,34.3 v12.2,34.4
  Bottom 0.254: v31.3,16 32.2,16 32.8,15.5 34.3,15.5 35.3,14.5 35.3,4.6 35.8,4.2 38.16,4.2 JP9.2 | v28,16.2 28,17 27.8,17.2 27.8,25.3 v27.4,25.7 27.4,27 27.3,27.1 25.9,27.1 25.5,27.5 25.5,34.1 v26,34.7 | v16.6,54.5 16.6,49 15.9,48.3 15.9,37.9 v12.2,34.4
SCK  (via drill 0.3)
  Top 0.254: U1.9 v22.4,15.4 | v22.8,13.2 24.9,13.2 27.4,11.2 29.93,11.2 J1.3
  Bottom 0.254: v22.4,15.4 22.4,13.6 v22.8,13.2
STATUSLED  (via drill 0.3)
  Top 0.254: R9.1 9.8,39.2 v9.1,38.5 | v11.7,57 19.6,57 24.7,51.9 BLE.15
  Bottom 0.254: v9.1,38.5 11.7,41.1 v11.7,57
TX  (via drill 0.3)
  Top 0.254: v32.1,15 v28,15 | v23.9,24.9 U1.20 | JP1.2 10.24,52.96 11.3,51.9 BLE.2 14.9,51.9 15.2,52.2 v15.2,55.3 | v24.6,34.3 22.2,34.3 22,34.4 21,34.4 20.7,34.2 15.6,34.2 15.4,34.4 14.8,34.4 14.4,34 14.4,33.5 11.8,33.5 11.6,33.7 11.3,33.7 v11.3,34.4
  Bottom 0.254: v32.1,15 33.9,15 34.8,14.1 34.8,2.7 36,1.7 JP9.1 | v28,15 27.7,15 27.3,15.4 27.3,24.6 27,24.9 v23.9,24.9 23.9,25.5 24.7,26.3 24.7,27.3 25.1,27.7 25.1,33.9 v24.6,34.3 | v15.2,55.3 15.2,38.3 v11.3,34.4
UCAP  (via drill 0.3)
  Top 0.254: U1.6 v20,14.2 | v25.3,11.5 C4.1
  Bottom 0.254: v20,14.2 20,13.7 20.5,13.2 21.4,13.2 22.2,12.4 24.4,12.4 v25.3,11.5
VBUS
  Top 0.254: JP7.VBUS 26.5,5.2 27.5,6.2 27.5,7.21 F1.1

### Text on the board
_tNames: RTS | TXD | RXD | + | 3.3V | Button | CTS | GND | BLE | USB | BLEPower | ~13 | BLE | D13 | status | 12 | Coin Cell | ~11 | RESET | ~10 | 3.3V | ~9 | 5V | 8 | GND | 7 | GND | ~6 | Vin | o | 5 | A0 | ICSP | 4 | A1 | 3 | A2 | 2 | A3 | ON | RESET | TX1 | A4 | RX1 | A5